# Altium schematic sheet back.SchDoc
size A4
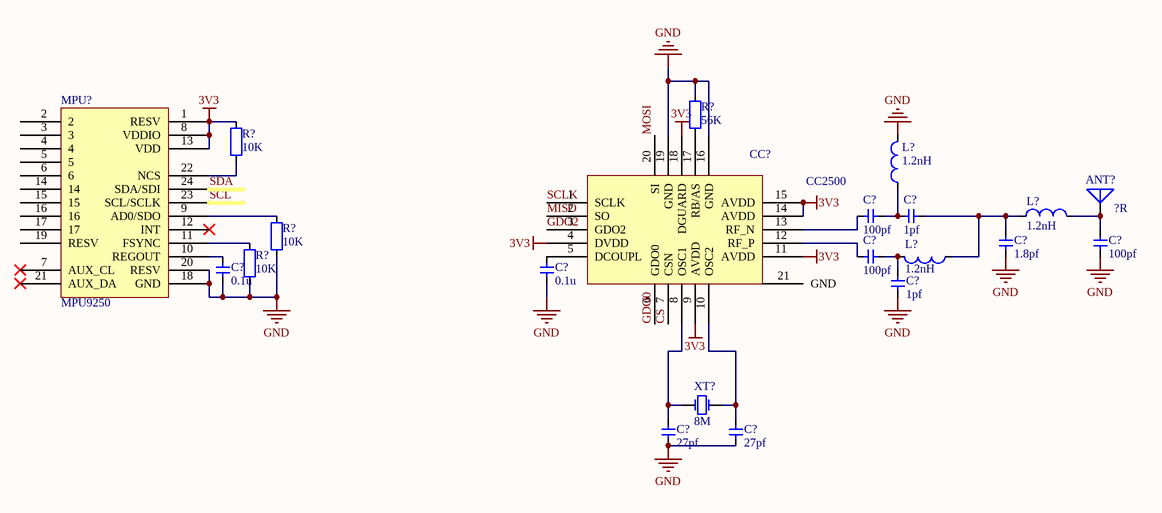
[diagram p0: back.SchDoc]

## Parts
(Parts that share a designator on the sheet are numbered #1, #2 ... from top to bottom, then left to right.)
ANT?  value ?R  [ANT_2.4G_3.2x1.6]  (hidden comment: Ant_2.4G)
C?#1  value 100pf  [CAP_0603]  (hidden comment: Cap_0603)
C?#2  value 1pf  [CAP_0603]  (hidden comment: Cap_0603)
C?#3  value 1.8pf  [CAP_0603]  (hidden comment: Cap_0603)
C?#4  value 100pf  [CAP_0603]  (hidden comment: Cap_0603)
C?#5  value 100pf  [CAP_0603]  (hidden comment: Cap_0603)
C?#6  value 0.1u  [CAP_0603]  (hidden comment: Cap_0603)
C?#7  value 0.1u  [CAP_0603]  (hidden comment: Cap_0603)
C?#8  value 1pf  [CAP_0603]  (hidden comment: Cap_0603)
C?#9  value 27pf  [CAP_0603]  (hidden comment: Cap_0603)
C?#10  value 27pf  [CAP_0603]  (hidden comment: Cap_0603)
CC?  CC2500  [CC2500]
L?#1  value 1.2nH  [IND_0603]  (hidden comment: Ind_0603)
L?#2  value 1.2nH  [IND_0603]  (hidden comment: Ind_0603)
L?#3  value 1.2nH  [IND_0603]  (hidden comment: Ind_0603)
MPU?  MPU9250  [QFN_P0.4_24]
R?#1  value 56K  [RES_0603]  (hidden comment: Res_0603)
R?#2  value 10K  [RES_0603]  (hidden comment: Res_0603)
R?#3  value 10K  [RES_0603]  (hidden comment: Res_0603)
R?#4  value 10K  [RES_0603]  (hidden comment: Res_0603)
XT?  value 8M  [XT_5032_2]  (hidden comment: XTAL_5032_2P)

## Nets
3V3: CC?.4(DVDD) CC?.9(AVDD) CC?.11(AVDD) CC?.14(AVDD) CC?.15(AVDD) CC?.18(DGUARD) MPU?.1(RESV) MPU?.8(VDDIO) MPU?.13(VDD) R?#2.1
GND: C?#3.1 C?#4.1 C?#6.1 C?#7.1 C?#8.2 C?#9.1 C?#10.1 CC?.16(GND) CC?.19(GND) L?#1.2 MPU?.18(GND) MPU?.20(RESV) R?#1.2 R?#3.2 R?#4.2
CS: CC?.7(CSN)
GDO0: CC?.6(GDO0)
GDO2: CC?.3(GDO2)
MISO: CC?.2(SO)
MOSI: CC?.20(SI)
SCL: MPU?.23(SCL/SCLK)
SCLK: CC?.1(SCLK)
SDA: MPU?.24(SDA/SDI)
NetANT?_1: ANT?.1(A) C?#4.2 L?#2.2
NetC?#1_1: C?#1.1 C?#2.2 L?#1.1
NetC?#1_2: C?#1.2 CC?.13(RF_N)
NetC?#2_1: C?#2.1 C?#3.2 L?#2.1 L?#3.1
NetC?#5_1: C?#5.1 C?#8.1 L?#3.2
NetC?#5_2: C?#5.2 CC?.12(RF_P)
NetC?#6_2: C?#6.2 MPU?.10(REGOUT)
NetC?#7_2: C?#7.2 CC?.5(DCOUPL)
NetC?#9_2: C?#9.2 CC?.8(OSC1) XT?.2(OSC2)
NetC?#10_2: C?#10.2 CC?.10(OSC2) XT?.1(OSC1)
NetCC?_17: CC?.17(RB/AS) R?#1.1
NetMPU?_9: MPU?.9(AD0/SDO) R?#3.1
NetMPU?_11: MPU?.11(FSYNC) R?#4.1
NetMPU?_22: MPU?.22(NCS) R?#2.2

Not connected (* = marked no-connect by the designer): CC? 21(GND); MPU? 2 3 4 5 6 7(AUX_CL)* 12(INT)* 14 15 16 17 19(RESV) 21(AUX_DA)*

## Library data of the parts
ANT? = Ant_2.4G: Antenna
C?#1-C?#10 = Cap_0603: Capacitor
L?#1-L?#3 = Ind_0603: Inductor
R?#1-R?#4 = Res_0603: Resistor
XT? = XTAL_5032_2P: Crystal Oscillator